# Altium project BeagleBone_Card.PrjPcb (part 4 of 4)

## Sheet 10_HDMI.SchDoc
size A3; Engineer: Mehmet Selcuk Yayan; Organization: Procenne
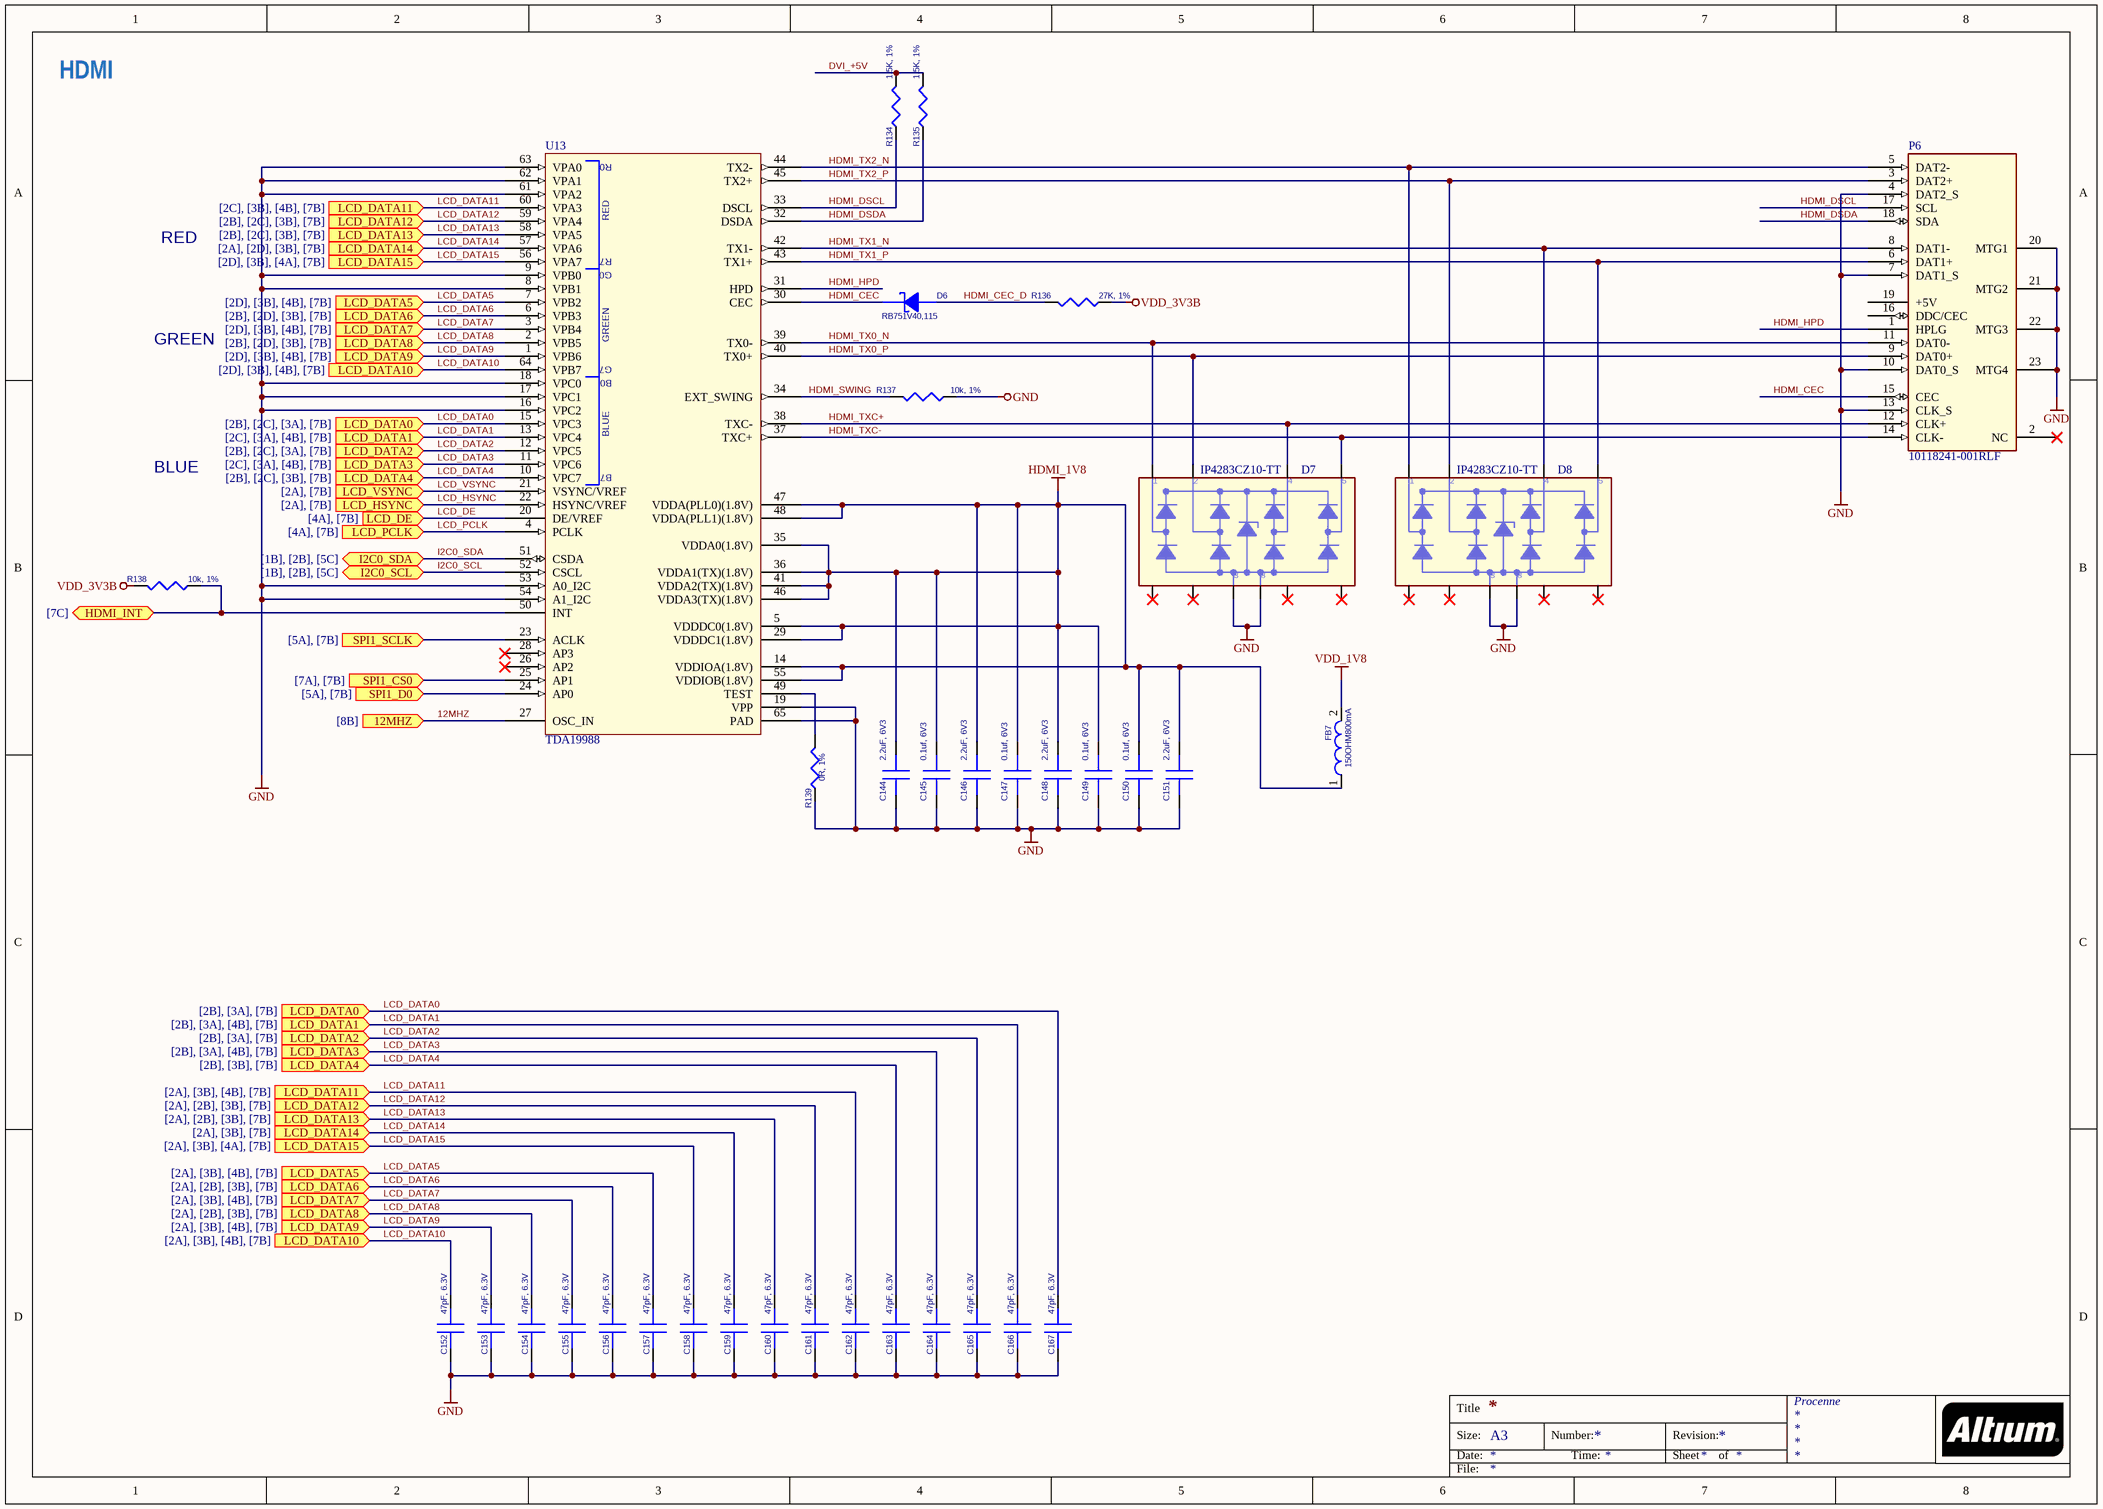
[diagram p11: 10_HDMI.SchDoc]

### Parts
C144  2.2uF, 6V3  [402]
C145  0.1uf, 6V3  [402]
C146  2.2uF, 6V3  [402]
C147  0.1uf, 6V3  [402]
C148  2.2uF, 6V3  [402]
C149  0.1uf, 6V3  [402]
C150  0.1uf, 6V3  [402]
C151  2.2uF, 6V3  [402]
C152  47pF, 6.3V  [402]
C153  47pF, 6.3V  [402]
C154  47pF, 6.3V  [402]
C155  47pF, 6.3V  [402]
C156  47pF, 6.3V  [402]
C157  47pF, 6.3V  [402]
C158  47pF, 6.3V  [402]
C159  47pF, 6.3V  [402]
C160  47pF, 6.3V  [402]
C161  47pF, 6.3V  [402]
C162  47pF, 6.3V  [402]
C163  47pF, 6.3V  [402]
C164  47pF, 6.3V  [402]
C165  47pF, 6.3V  [402]
C166  47pF, 6.3V  [402]
C167  47pF, 6.3V  [402]
D6  RB751V40,115  [SOD323]
D7  IP4283CZ10-TT  [TSSOP10]
D8  IP4283CZ10-TT  [TSSOP10]
FB7  150OHM800mA  [SM-7351-IND-0805]
P6  10118241-001RLF  [CONN19_HDMI]
R134  1.5K, 1%  [402]
R135  1.5K, 1%  [402]
R136  27K, 1%  [402]
R137  10k, 1%  [402]
R138  10k, 1%  [402]
R139  0R, 1%  [402]
U13  TDA19988  [QFN64S9X9P5]

### Ports
12MHZ (in, see [8B]), HDMI_INT (bidir, see [7C]), I2C0_SCL (bidir, see [1B], [2B], [5C]), I2C0_SDA (bidir, see [1B], [2B], [5C]), LCD_DATA0 (in, see [2B], [2C], [3A], [7B]), LCD_DATA0 (in, see [2B], [3A], [7B]), LCD_DATA1 (in, see [2B], [3A], [4B], [7B]), LCD_DATA1 (in, see [2C], [3A], [4B], [7B]), LCD_DATA2 (in, see [2B], [2C], [3A], [7B]), LCD_DATA2 (in, see [2B], [3A], [7B]), LCD_DATA3 (in, see [2B], [3A], [4B], [7B]), LCD_DATA3 (in, see [2C], [3A], [4B], [7B]), LCD_DATA4 (in, see [2B], [2C], [3B], [7B]), LCD_DATA4 (in, see [2B], [3B], [7B]), LCD_DATA5 (in, see [2A], [3B], [4B], [7B]), LCD_DATA5 (in, see [2D], [3B], [4B], [7B]), LCD_DATA6 (in, see [2A], [2B], [3B], [7B]), LCD_DATA6 (in, see [2B], [2D], [3B], [7B]), LCD_DATA7 (in, see [2A], [3B], [4B], [7B]), LCD_DATA7 (in, see [2D], [3B], [4B], [7B]), LCD_DATA8 (in, see [2A], [2B], [3B], [7B]), LCD_DATA8 (in, see [2B], [2D], [3B], [7B]), LCD_DATA9 (in, see [2A], [3B], [4B], [7B]), LCD_DATA9 (in, see [2D], [3B], [4B], [7B]), LCD_DATA10 (in, see [2A], [3B], [4B], [7B]), LCD_DATA10 (in, see [2D], [3B], [4B], [7B]), LCD_DATA11 (in, see [2A], [3B], [4B], [7B]), LCD_DATA11 (in, see [2C], [3B], [4B], [7B]), LCD_DATA12 (in, see [2A], [2B], [3B], [7B]), LCD_DATA12 (in, see [2B], [2C], [3B], [7B]), LCD_DATA13 (in, see [2A], [2B], [3B], [7B]), LCD_DATA13 (in, see [2B], [2C], [3B], [7B]), LCD_DATA14 (in, see [2A], [2D], [3B], [7B]), LCD_DATA14 (in, see [2A], [3B], [7B]), LCD_DATA15 (in, see [2A], [3B], [4A], [7B]), LCD_DATA15 (in, see [2D], [3B], [4A], [7B]), LCD_DE (in, see [4A], [7B]), LCD_HSYNC (in, see [2A], [7B]), LCD_PCLK (in, see [4A], [7B]), LCD_VSYNC (in, see [2A], [7B]), SPI1_CS0 (in, see [7A], [7B]), SPI1_D0 (in, see [5A], [7B]), SPI1_SCLK (in, see [5A], [7B])

### Nets
GND: C144.2 C145.2 C146.2 C147.2 C148.2 C149.2 C150.2 C151.2 C152.2 C153.2 C154.2 C155.2 C156.2 C157.2 C158.2 C159.2 C160.2 C161.2 C162.2 C163.2 C164.2 C165.2 C166.2 C167.2 D7.3 D7.8 D8.3 D8.8 P6.4(DAT2_S) P6.7(DAT1_S) P6.10(DAT0_S) P6.13(CLK_S) P6.20(MTG1) P6.21(MTG2) P6.22(MTG3) P6.23(MTG4) R137.2(P2) R139.2(P2) U13.8(VPB1) U13.9(VPB0) U13.16(VPC2) U13.17(VPC1) U13.18(VPC0) U13.19(VPP) U13.53(A0_I2C) U13.54(A1_I2C) U13.61(VPA2) U13.62(VPA1) U13.63(VPA0) U13.65(PAD)
HDMI_1V8: C144.1 C145.1 C146.1 C147.1 C148.1 C149.1 C150.1 C151.1 FB7.1 U13.5(VDDDC0(1.8V)) U13.14(VDDIOA(1.8V)) U13.29(VDDDC1(1.8V)) U13.35(VDDA0(1.8V)) U13.36(VDDA1(TX)(1.8V)) U13.41(VDDA2(TX)(1.8V)) U13.46(VDDA3(TX)(1.8V)) U13.47(VDDA(PLL0)(1.8V)) U13.48(VDDA(PLL1)(1.8V)) U13.55(VDDIOB(1.8V))
VDD_1V8: FB7.2
VDD_3V3B: R136.2(P2) R138.1(P1)
12MHZ: U13.27(OSC_IN) ; port 12MHZ
DVI_+5V: R134.1(P1) R135.1(P1)
HDMI_CEC: D6.1(C) P6.15(CEC) U13.30(CEC)
HDMI_CEC_D: D6.2(A) R136.1(P1)
HDMI_DSCL: P6.17(SCL) R134.2(P2) U13.33(DSCL)
HDMI_DSDA: P6.18(SDA) R135.2(P2) U13.32(DSDA)
HDMI_HPD: P6.1(HPLG) U13.31(HPD)
HDMI_INT: R138.2(P2) U13.50(INT) ; port HDMI_INT
HDMI_SWING: R137.1(P1) U13.34(EXT_SWING)
HDMI_TX0_N: D7.1 P6.11(DAT0-) U13.39(TX0-)
HDMI_TX0_P: D7.2 P6.9(DAT0+) U13.40(TX0+)
HDMI_TX1_N: D8.4 P6.8(DAT1-) U13.42(TX1-)
HDMI_TX1_P: D8.5 P6.6(DAT1+) U13.43(TX1+)
HDMI_TX2_N: D8.1 P6.5(DAT2-) U13.44(TX2-)
HDMI_TX2_P: D8.2 P6.3(DAT2+) U13.45(TX2+)
HDMI_TXC+: D7.4 P6.12(CLK+) U13.38(TXC-)
HDMI_TXC-: D7.5 P6.14(CLK-) U13.37(TXC+)
I2C0_SCL: U13.52(CSCL) ; port I2C0_SCL
I2C0_SDA: U13.51(CSDA) ; port I2C0_SDA
LCD_DATA0: C167.1 U13.15(VPC3) ; port LCD_DATA0
LCD_DATA1: C166.1 U13.13(VPC4) ; port LCD_DATA1
LCD_DATA2: C165.1 U13.12(VPC5) ; port LCD_DATA2
LCD_DATA3: C164.1 U13.11(VPC6) ; port LCD_DATA3
LCD_DATA4: C163.1 U13.10(VPC7) ; port LCD_DATA4
LCD_DATA5: C157.1 U13.7(VPB2) ; port LCD_DATA5
LCD_DATA6: C156.1 U13.6(VPB3) ; port LCD_DATA6
LCD_DATA7: C155.1 U13.3(VPB4) ; port LCD_DATA7
LCD_DATA8: C154.1 U13.2(VPB5) ; port LCD_DATA8
LCD_DATA9: C153.1 U13.1(VPB6) ; port LCD_DATA9
LCD_DATA10: C152.1 U13.64(VPB7) ; port LCD_DATA10
LCD_DATA11: C162.1 U13.60(VPA3) ; port LCD_DATA11
LCD_DATA12: C161.1 U13.59(VPA4) ; port LCD_DATA12
LCD_DATA13: C160.1 U13.58(VPA5) ; port LCD_DATA13
LCD_DATA14: C159.1 U13.57(VPA6) ; port LCD_DATA14
LCD_DATA15: C158.1 U13.56(VPA7) ; port LCD_DATA15
LCD_DE: U13.20(DE/VREF) ; port LCD_DE
LCD_HSYNC: U13.22(HSYNC/VREF) ; port LCD_HSYNC
LCD_PCLK: U13.4(PCLK) ; port LCD_PCLK
LCD_VSYNC: U13.21(VSYNC/VREF) ; port LCD_VSYNC
SPI1_CS0: U13.25(AP1) ; port SPI1_CS0
SPI1_D0: U13.24(AP0) ; port SPI1_D0
SPI1_SCLK: U13.23(ACLK) ; port SPI1_SCLK
NetR139_1: R139.1(P1) U13.49(TEST)

Not connected (* = marked no-connect by the designer): D7 6* 7* 9* 10*; D8 6* 7* 9* 10*; P6 2(NC)* 16(DDC/CEC) 19(+5V); U13 26(AP2)* 28(AP3)*

### Notes on the sheet
- HDMI
- RED
- GREEN
- BLUE
- Title
- Size:
- Date:
- A3
- Number:
- Time:
- Revision:
- Sheet
- of
- File:
- (in symbol TDA19988) R0; RED; R7; G0; GREEN; G7; B0; BLUE; B7

### Library data of the parts
C144 C146 C148 C151 = CAP SMD: CAP CER 2.2UF 6.3V 10% X5R 0402; Manufacturer: TDK Corporation; Manufacturer Part Number: C1005X5R0J225K050BC; Capacitance: 2.2µF; Supplier 1: Digi-Key; Supplier Part Number 1: 445-6847-6-ND; RoHS: RoHS Compliant; Category: Capacitors; Stock 1: 186346; Pricing 1: 1=0.24, 10=0.2, 100=0.1, 250=0.075, 500=0.06626, 1000=0.05875, 5000=0.04875 (USD); Voltage - Rated: 6.3V; Tolerance: ±10%; Temperature Coefficient: X5R; Mounting Type: Surface Mount, MLCC; Operating Temperature: -55°C ~ 85°C; Applications: General Purpose; Ratings: -; Package / Case: 0402 (1005 Metric); Size / Dimension: 0.039" L x 0.020" W (1.00mm x 0.50mm); Height - Seated (Max): -; Thickness (Max): 0.022" (0.55mm); Lead Spacing: -; Features: -; Packaging: Digi-Reel®; Lead Style: -; ComponentLink1URL: http://product.tdk.com/capacitor/mlcc/en/documents/mlcc_commercial_general_en.pdf; ComponentLink1Description: http://product.tdk.com/capacitor/mlcc/en/documents/mlcc_commercial_general_en.pdf
C145 C147 C149 C150 = CAP SMD: CAP CER 0.1UF 6.3V 10% X5R 0402; Manufacturer: TDK Corporation; Manufacturer Part Number: C1005X5R0J104K050BA; Capacitance: 0.1µF; Supplier 1: Digi-Key; Supplier Part Number 1: 445-1266-6-ND; RoHS: RoHS Compliant; Category: Capacitors; Stock 1: 127094; Pricing 1: 1=0.1, 10=0.026, 100=0.0121, 250=0.00992, 500=0.00848, 1000=0.0066, 5000=0.0055 (USD); Voltage - Rated: 6.3V; Tolerance: ±10%; Temperature Coefficient: X5R; Mounting Type: Surface Mount, MLCC; Operating Temperature: -55°C ~ 85°C; Applications: General Purpose; Ratings: -; Package / Case: 0402 (1005 Metric); Size / Dimension: 0.039" L x 0.020" W (1.00mm x 0.50mm); Height - Seated (Max): -; Thickness (Max): 0.022" (0.55mm); Lead Spacing: -; Features: -; Packaging: Digi-Reel®; Lead Style: -; ComponentLink1URL: http://product.tdk.com/capacitor/mlcc/en/documents/mlcc_commercial_general_en.pdf; ComponentLink1Description: http://product.tdk.com/capacitor/mlcc/en/documents/mlcc_commercial_general_en.pdf
C152-C167 = CAP SMD: CAP CER 47PF 50V 5% NP0 0402; Manufacturer: TDK Corporation; Manufacturer Part Number: C1005C0G1H470J050BA; Temperature Coefficient: C0G, NP0; Supplier 1: Digi-Key; Supplier Part Number 1: 445-1243-6-ND; RoHS: RoHS Compliant; Category: Capacitors; Stock 1: 0; Pricing 1: 1=0.1, 10=0.024, 100=0.011, 250=0.009, 500=0.0077, 1000=0.006, 5000=0.005 (USD); Capacitance: 47pF; Voltage - Rated: 50V; Tolerance: ±5%; Mounting Type: Surface Mount, MLCC; Operating Temperature: -55°C ~ 125°C; Applications: General Purpose; Ratings: -; Package / Case: 0402 (1005 Metric); Size / Dimension: 0.039" L x 0.020" W (1.00mm x 0.50mm); Height - Seated (Max): -; Thickness (Max): 0.022" (0.55mm); Lead Spacing: -; Features: -; Packaging: Digi-Reel®; Lead Style: -; ComponentLink1URL: http://product.tdk.com/capacitor/mlcc/en/documents/mlcc_commercial_general_en.pdf; ComponentLink1Description: http://product.tdk.com/capacitor/mlcc/en/documents/mlcc_commercial_general_en.pdf
D6 = Zener: DIODE SCHOTTKY 40V 120MA SOD323; Manufacturer: NXP Semiconductors; Current - Average Rectified (Io): 120mA (DC); Voltage - Forward (Vf) (Max) @ If: 370mV @ 1mA; Speed: Small Signal =< 200mA (Io), Any Speed; Current - Reverse Leakage @ Vr: 500nA @ 30V; Capacitance @ Vr, F: 2pF @ 1V, 1MHz; Supplier 1: Digi-Key; Supplier Part Number 1: 568-8119-6-ND; Manufacturer Part Number: RB751V40,115; RoHS: RoHS Compliant; Category: Discrete Semiconductor Products; Stock 1: 5326; Pricing 1: 1=0.29, 10=0.26, 25=0.1872, 100=0.1456, 250=0.09152, 500=0.07798, 1000=0.05313 (USD); Diode Type: Schottky; Voltage - DC Reverse (Vr) (Max): 40V; Reverse Recovery Time (trr): -; Mounting Type: Surface Mount; Package / Case: SC-76, SOD-323; Supplier Device Package: SOD-323; Packaging: Digi-Reel®; ComponentLink1URL: http://www.nxp.com/documents/data_sheet/RB751_SER.pdf; ComponentLink1Description: http://www.nxp.com/documents/data_sheet/RB751_SER.pdf
D7 D8 = 32CTQ030/TO_1: DIODE ESD PROT HDMI 10TSSOP; Manufacturer: NXP Semiconductors; Manufacturer Part Number: IP4283CZ10-TT,118; Voltage - Reverse Standoff (Typ): 3V; Voltage - Breakdown: 6V; Polarization: 4 Channel Array - Unidirectional; Supplier 1: Digi-Key; Supplier Part Number 1: 568-5875-6-ND; RoHS: RoHS Compliant; Category: Circuit Protection; Stock 1: 1067; Pricing 1: 1=0.85, 10=0.743, 25=0.6568, 100=0.5724, 250=0.49828, 500=0.42416, 1000=0.33974 (USD); Power (Watts): -; Mounting Type: Surface Mount; Package / Case: 10-TFSOP, 10-MSOP (0.118", 3.00mm Width); Supplier Device Package: 10-TSSOP; Packaging: Digi-Reel®; ComponentLink1URL: http://media.digikey.com/pdf/Data%20Sheets/NXP%20PDFs/IP4283CZ10.pdf; ComponentLink1Description: http://media.digikey.com/pdf/Data%20Sheets/NXP%20PDFs/IP4283CZ10.pdf
FB7 = IND: FERRITE 800MA 150 OHM 0805 SMD; Manufacturer: Laird-Signal Integrity Products; Manufacturer Part Number: LI0805H151R-10; Impedance @ Frequency: 150 Ohm @ 100MHz; DC Resistance (DCR): 150 mOhm Max; Filter Type: Differential Mode - Single; Supplier 1: Digi-Key; Supplier Part Number 1: 240-2384-6-ND; RoHS: RoHS Compliant; Category: Filters; Stock 1: 10144; Pricing 1: 1=0.1, 10=0.07, 25=0.064, 50=0.0574, 100=0.0421, 250=0.03064, 500=0.02808, 1000=0.02424 (USD); Current Rating: 800mA; Package / Case: 0805 (2012 Metric); Mounting Type: Surface Mount; Packaging: Digi-Reel®; Height (Max): 0.043" (1.10mm); Size / Dimension: 0.079" L x 0.049" W (2.00mm x 1.25mm); ComponentLink1URL: http://www.lairdtech.com/WorkArea/linkit.aspx?LinkIdentifier=id&ItemID=4912; ComponentLink1Description: http://www.lairdtech.com/WorkArea/linkit.aspx?LinkIdentifier=id&ItemID=4912
P6 = Micro HDMI: CONN HDMI RECPT 19POS SMT R/A; Manufacturer: FCI; Number of Contacts: 19; Gender: Receptacle; Supplier 1: Digi-Key; Supplier Part Number 1: 609-4615-6-ND; Manufacturer Part Number: 10118241-001RLF; RoHS: RoHS Compliant; Category: Connectors, Interconnects; Stock 1: 6779; Pricing 1: 1=1.34, 10=1.174, 25=1.1052, 50=1.059, 100=1.013, 250=0.92092 (USD); Connector Type: HDMI; Specifications: -; Mounting Type: Surface Mount, Right Angle, Horizontal; Features: Shielded, Solder Retention; Packaging: Digi-Reel®; Ingress Protection: -; ComponentLink1URL: http://portal.fciconnect.com/Comergent//fci/drawing/10118241.pdf; ComponentLink1Description: http://portal.fciconnect.com/Comergent//fci/drawing/10118241.pdf
R134 R135 = RES SMD: RES 1.50K OHM 1/16W 1% 0402 SMD; Manufacturer: Yageo; Manufacturer Part Number: RC0402FR-071K5L; Power (Watts): 0.063W, 1/16W; Temperature Coefficient: ±100ppm/°C; Supplier 1: Digi-Key; Supplier Part Number 1: 311-1.50KLRDKR-ND; RoHS: RoHS Compliant; Category: Resistors; Stock 1: 434146; Pricing 1: 1=0.1, 10=0.014, 25=0.0104, 100=0.0063, 250=0.0054, 500=0.00382, 1000=0.0027, 2500=0.00234, 5000=0.00203 (USD); Resistance (Ohms): 1.5k; Composition: Thick Film; Features: -; Tolerance: ±1%; Package / Case: 0402 (1005 Metric); Supplier Device Package: 0402; Size / Dimension: 0.039" L x 0.020" W (1.00mm x 0.50mm); Height: 0.016" (0.40mm); Number of Terminations: 2; Packaging: Digi-Reel®; ComponentLink1URL: http://www.yageo.com/documents/recent/PYu-RC0402_51_RoHS_L_6.pdf; ComponentLink1Description: http://www.yageo.com/documents/recent/PYu-RC0402_51_RoHS_L_6.pdf
R136 = RES SMD: RES 27.0K OHM 1/16W 1% 0402 SMD; Manufacturer: Yageo; Manufacturer Part Number: RC0402FR-0727KL; Power (Watts): 0.063W, 1/16W; Temperature Coefficient: ±100ppm/°C; Supplier 1: Digi-Key; Supplier Part Number 1: 311-27.0KLRDKR-ND; RoHS: RoHS Compliant; Category: Resistors; Stock 1: 115508; Pricing 1: 1=0.1, 10=0.014, 25=0.0104, 100=0.0063, 250=0.0054, 500=0.00382, 1000=0.0027, 2500=0.00234, 5000=0.00203 (USD); Resistance (Ohms): 27k; Composition: Thick Film; Features: -; Tolerance: ±1%; Package / Case: 0402 (1005 Metric); Supplier Device Package: 0402; Size / Dimension: 0.039" L x 0.020" W (1.00mm x 0.50mm); Height: 0.016" (0.40mm); Number of Terminations: 2; Packaging: Digi-Reel®; ComponentLink1URL: http://www.yageo.com/documents/recent/PYu-RC0402_51_RoHS_L_6.pdf; ComponentLink1Description: http://www.yageo.com/documents/recent/PYu-RC0402_51_RoHS_L_6.pdf
R137 R138 = RES SMD: RES 10K OHM 1/16W 5% 0402 SMD; Manufacturer: Rohm Semiconductor; Manufacturer Part Number: MCR01MZPJ103; Power (Watts): 0.063W, 1/16W; Temperature Coefficient: ±200ppm/°C; Supplier 1: Digi-Key; Supplier Part Number 1: RHM10KJDKR-ND; RoHS: RoHS Compliant; Category: Resistors; Stock 1: 460442; Pricing 1: 1=0.1, 10=0.019, 25=0.014, 100=0.0078, 250=0.00596, 500=0.00476, 1000=0.0035, 5000=0.00251 (USD); Resistance (Ohms): 10k; Composition: Thick Film; Features: Automotive AEC-Q200 Qualified; Tolerance: ±5%; Package / Case: 0402 (1005 Metric); Supplier Device Package: 0402 (1005 Metric); Size / Dimension: 0.039" L x 0.020" W (1.00mm x 0.50mm); Height: 0.016" (0.40mm); Number of Terminations: 2; Packaging: Digi-Reel®; ComponentLink1URL: http://rohmfs.rohm.com/en/products/databook/datasheet/passive/resistor/chip_resistor/mcr_a.pdf; ComponentLink1Description: http://rohmfs.rohm.com/en/products/databook/datasheet/passive/resistor/chip_resistor/mcr_a.pdf
R139 = RES SMD: RES 0.0 OHM 1/16W 0402 SMD; Manufacturer: Yageo; Manufacturer Part Number: RC0402JR-070RL; Resistance (Ohms): 0.0; Power (Watts): 0.063W, 1/16W; Tolerance: Jumper; Supplier 1: Digi-Key; Supplier Part Number 1: 311-0.0JRDKR-ND; RoHS: RoHS Compliant; Category: Resistors; Stock 1: 4565215; Pricing 1: 1=0.1, 10=0.012, 25=0.0092, 100=0.0055, 250=0.00476, 500=0.00336, 1000=0.00237, 2500=0.00206, 5000=0.00178 (USD); Composition: Thick Film; Features: -; Temperature Coefficient: -; Package / Case: 0402 (1005 Metric); Supplier Device Package: 0402; Size / Dimension: 0.039" L x 0.020" W (1.00mm x 0.50mm); Height: 0.016" (0.40mm); Number of Terminations: 2; Packaging: Digi-Reel®; ComponentLink1URL: http://www.yageo.com/documents/recent/PYu-RC0402_51_RoHS_L_6.pdf; ComponentLink1Description: http://www.yageo.com/documents/recent/PYu-RC0402_51_RoHS_L_6.pdf
U13 = TDA19988: IC HDMI TRANSMITTER 64-HVQFN; Manufacturer: NXP Semiconductors; Manufacturer Part Number: TDA19988AHN/C1,551; Supplier 1: Digi-Key; Supplier Part Number 1: TDA19988AHN/C1,551-ND; RoHS: RoHS Compliant; Category: Integrated Circuits (ICs); Stock 1: 0; Pricing 1: 260=4.59 (USD); Type: HDMI Transmitter; Applications: Set-Top Boxes; Mounting Type: Surface Mount; Package / Case: 64-VFQFN Exposed Pad; Supplier Device Package: 64-HVQFN (9x9); Packaging: Tray

## Sheet 11_Miscellaneous.SchDoc
size A3; Engineer: Mehmet Selcuk Yayan; Organization: Procenne
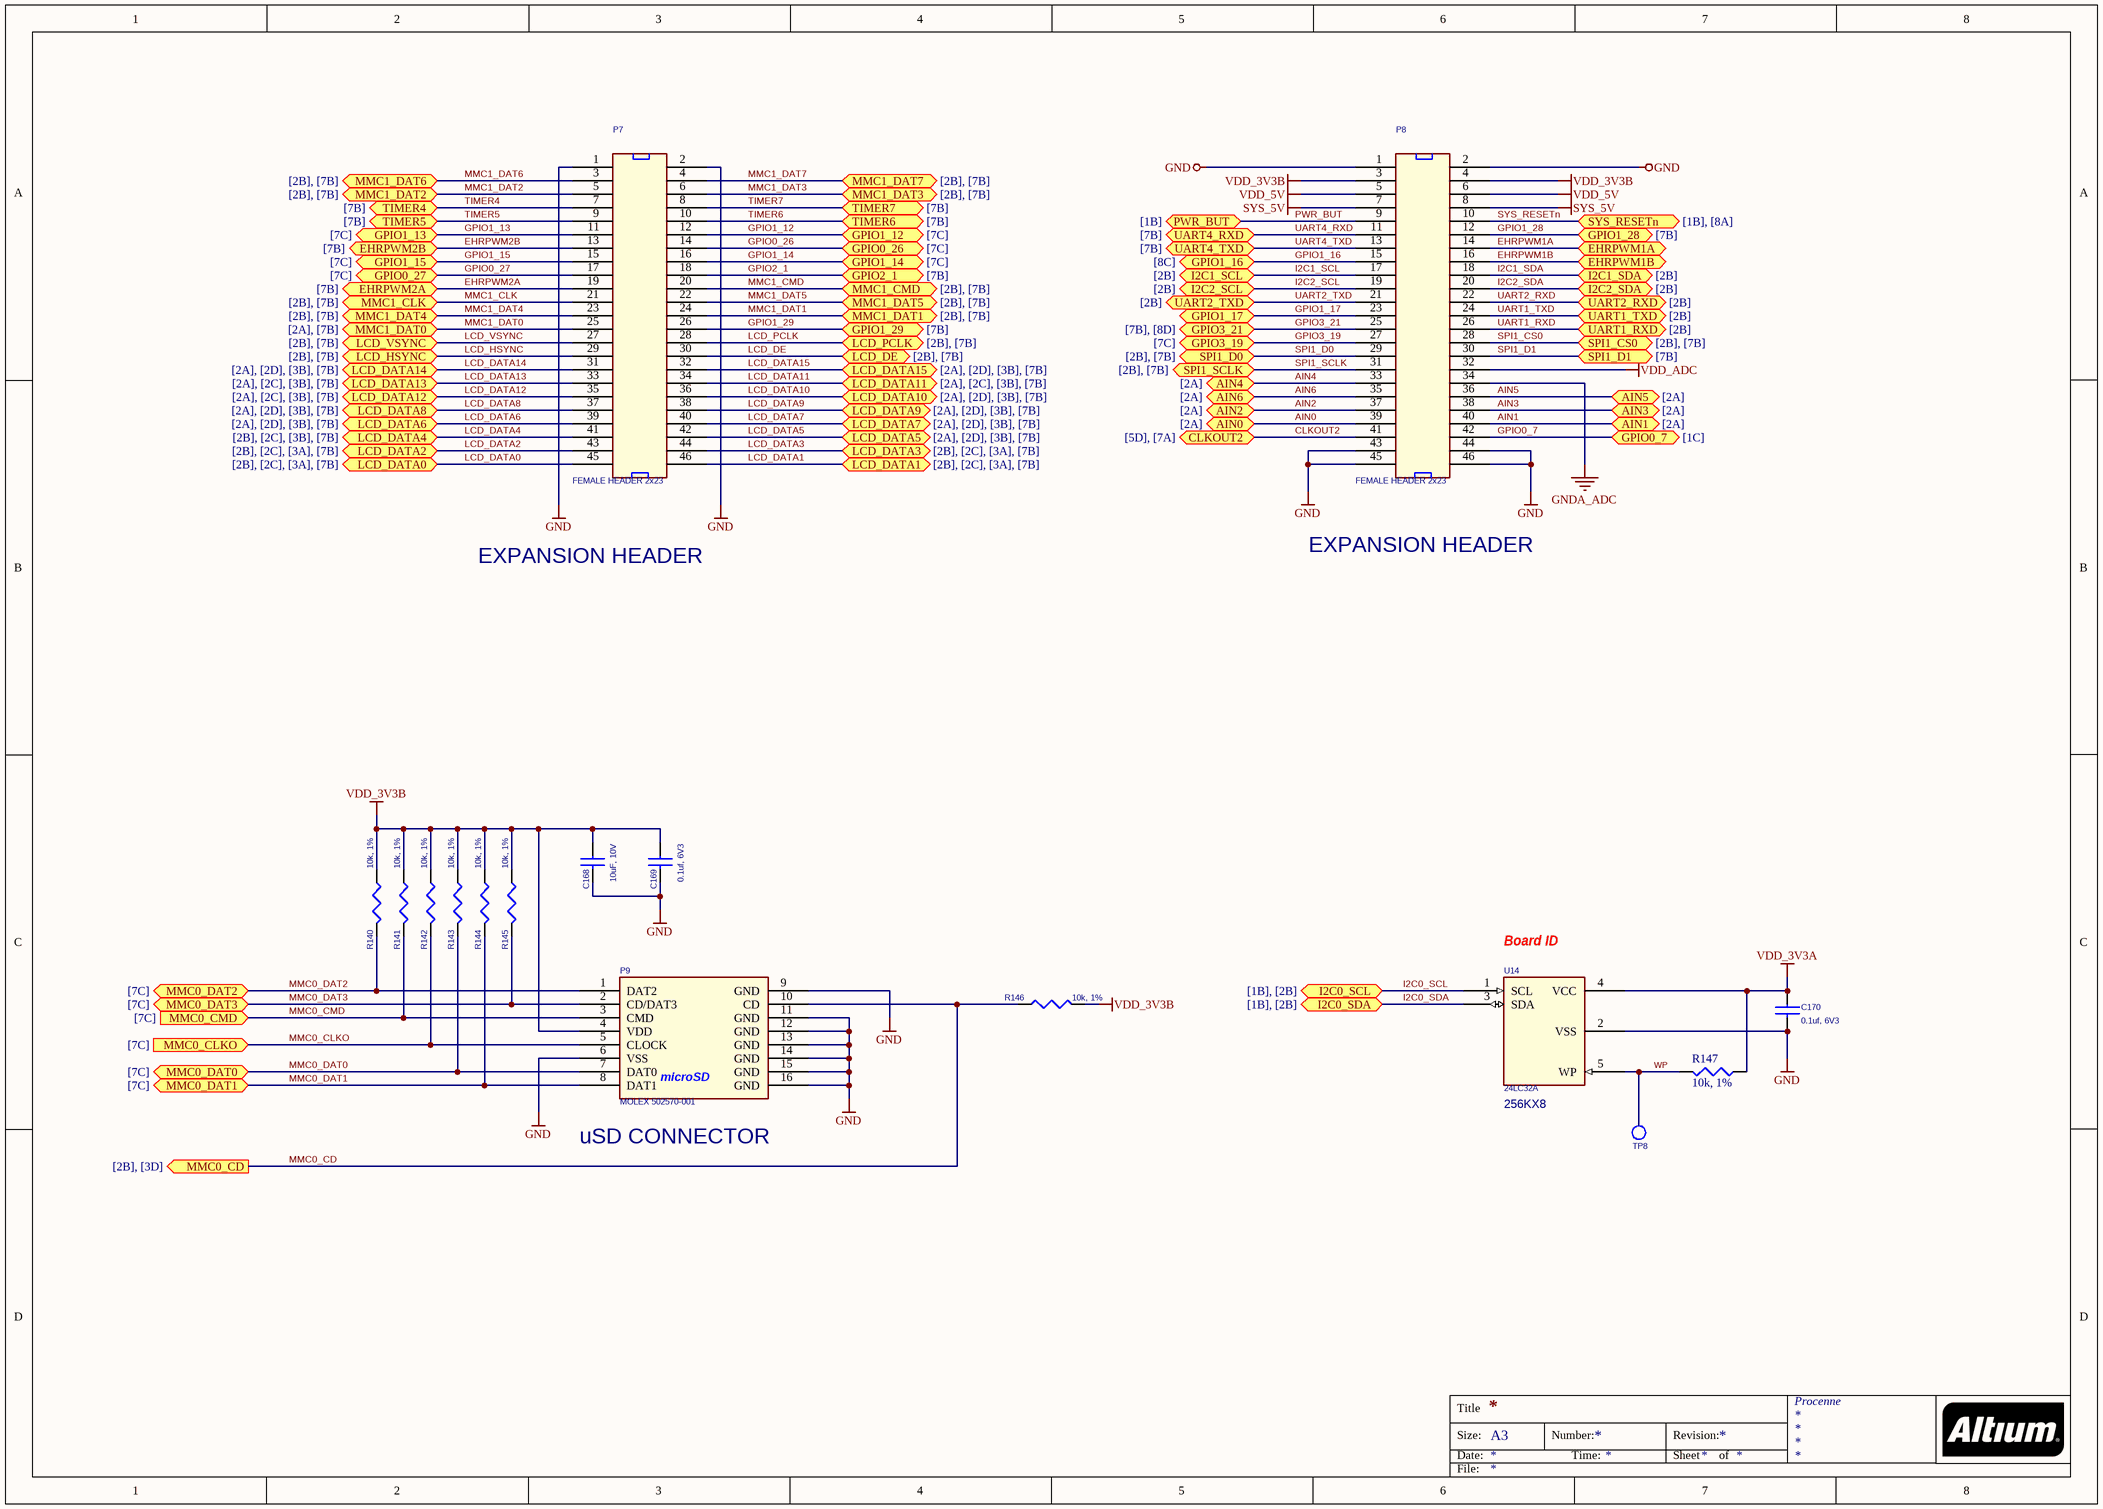
[diagram p12: 11_Miscellaneous.SchDoc]

### Parts
C168  10uF, 10V  [805]
C169  0.1uf, 6V3  [402]
C170  0.1uf, 6V3  [402]
P7  FEMALE HEADER 2x23  [HEADER23X2]
P8  FEMALE HEADER 2x23  [HEADER23X2]
P9  MOLEX 502570-001  [SD-MICRO-SCHA5B0300]
R140  10k, 1%  [402]
R141  10k, 1%  [402]
R142  10k, 1%  [402]
R143  10k, 1%  [402]
R144  10k, 1%  [402]
R145  10k, 1%  [402]
R146  10k, 1%  [402]
R147  10k, 1%  [402]
TP8  TESTPT1  [tp1-8040]  (value not drawn)  (no BOM)
U14  24LC32A  [SOT23-5]

### Ports
AIN0 (bidir, see [2A]), AIN1 (bidir, see [2A]), AIN2 (bidir, see [2A]), AIN3 (bidir, see [2A]), AIN4 (bidir, see [2A]), AIN5 (bidir, see [2A]), AIN6 (bidir, see [2A]), CLKOUT2 (bidir, see [5D], [7A]), EHRPWM1A (bidir), EHRPWM1B (bidir), EHRPWM2A (bidir, see [7B]), EHRPWM2B (bidir, see [7B]), GPIO0_7 (bidir, see [1C]), GPIO0_26 (bidir, see [7C]), GPIO0_27 (bidir, see [7C]), GPIO1_12 (bidir, see [7C]), GPIO1_13 (bidir, see [7C]), GPIO1_14 (bidir, see [7C]), GPIO1_15 (bidir, see [7C]), GPIO1_16 (bidir, see [8C]), GPIO1_17 (bidir), GPIO1_28 (bidir, see [7B]), GPIO1_29 (bidir, see [7B]), GPIO2_1 (bidir, see [7B]), GPIO3_19 (bidir, see [7C]), GPIO3_21 (bidir, see [7B], [8D]), I2C0_SCL (bidir, see [1B], [2B]), I2C0_SDA (bidir, see [1B], [2B]), I2C1_SCL (bidir, see [2B]), I2C1_SDA (bidir, see [2B]), I2C2_SCL (bidir, see [2B]), I2C2_SDA (bidir, see [2B]), LCD_DATA0 (bidir, see [2B], [2C], [3A], [7B]), LCD_DATA1 (bidir, see [2B], [2C], [3A], [7B]), LCD_DATA2 (bidir, see [2B], [2C], [3A], [7B]), LCD_DATA3 (bidir, see [2B], [2C], [3A], [7B]), LCD_DATA4 (bidir, see [2B], [2C], [3B], [7B]), LCD_DATA5 (bidir, see [2A], [2D], [3B], [7B]), LCD_DATA6 (bidir, see [2A], [2D], [3B], [7B]), LCD_DATA7 (bidir, see [2A], [2D], [3B], [7B]), LCD_DATA8 (bidir, see [2A], [2D], [3B], [7B]), LCD_DATA9 (bidir, see [2A], [2D], [3B], [7B]), LCD_DATA10 (bidir, see [2A], [2D], [3B], [7B]), LCD_DATA11 (bidir, see [2A], [2C], [3B], [7B]), LCD_DATA12 (bidir, see [2A], [2C], [3B], [7B]), LCD_DATA13 (bidir, see [2A], [2C], [3B], [7B]), LCD_DATA14 (bidir, see [2A], [2D], [3B], [7B]), LCD_DATA15 (bidir, see [2A], [2D], [3B], [7B]), LCD_DE (bidir, see [2B], [7B]), LCD_HSYNC (bidir, see [2B], [7B]), LCD_PCLK (bidir, see [2B], [7B]), LCD_VSYNC (bidir, see [2B], [7B]), MMC0_CD (out, see [2B], [3D]), MMC0_CLKO (in, see [7C]), MMC0_CMD (in, see [7C]), MMC0_DAT0 (bidir, see [7C]), MMC0_DAT1 (bidir, see [7C]), MMC0_DAT2 (bidir, see [7C]), MMC0_DAT3 (bidir, see [7C]), MMC1_CLK (bidir, see [2B], [7B]), MMC1_CMD (bidir, see [2B], [7B]), MMC1_DAT0 (bidir, see [2A], [7B]), MMC1_DAT1 (bidir, see [2B], [7B]), MMC1_DAT2 (bidir, see [2B], [7B]), MMC1_DAT3 (bidir, see [2B], [7B]), MMC1_DAT4 (bidir, see [2B], [7B]), MMC1_DAT5 (bidir, see [2B], [7B]), MMC1_DAT6 (bidir, see [2B], [7B]), MMC1_DAT7 (bidir, see [2B], [7B]), PWR_BUT (bidir, see [1B]), SPI1_CS0 (bidir, see [2B], [7B]), SPI1_D0 (bidir, see [2B], [7B]), SPI1_D1 (bidir, see [7B]), SPI1_SCLK (bidir, see [2B], [7B]), SYS_RESETn (bidir, see [1B], [8A]), TIMER4 (bidir, see [7B]), TIMER5 (bidir, see [7B]), TIMER6 (bidir, see [7B]), TIMER7 (bidir, see [7B]), UART1_RXD (bidir, see [2B]), UART1_TXD (bidir, see [2B]), UART2_RXD (bidir, see [2B]), UART2_TXD (bidir, see [2B]), UART4_RXD (bidir, see [7B]), UART4_TXD (bidir, see [7B])

### Nets
GND: C168.2 C169.2 C170.2 P7.1 P7.2 P8.1 P8.2 P8.43 P8.44 P8.45 P8.46 P9.6(VSS) P9.9(GND) P9.11(GND) P9.12(GND) P9.13(GND) P9.14(GND) P9.15(GND) P9.16(GND) U14.2(VSS)
GNDA_ADC: P8.34
SYS_5V: P8.7 P8.8
VDD_3V3A: C170.1 R147.1 U14.4(VCC)
VDD_3V3B: C168.1 C169.1 P8.3 P8.4 P9.4(VDD) R140.1 R141.1 R142.1 R143.1 R144.1 R145.1 R146.2
VDD_5V: P8.5 P8.6
VDD_ADC: P8.32
AIN0: P8.39 ; port AIN0
AIN1: P8.40 ; port AIN1
AIN2: P8.37 ; port AIN2
AIN3: P8.38 ; port AIN3
AIN4: P8.33 ; port AIN4
AIN5: P8.36 ; port AIN5
AIN6: P8.35 ; port AIN6
CLKOUT2: P8.41 ; port CLKOUT2
EHRPWM1A: P8.14 ; port EHRPWM1A
EHRPWM1B: P8.16 ; port EHRPWM1B
EHRPWM2A: P7.19 ; port EHRPWM2A
EHRPWM2B: P7.13 ; port EHRPWM2B
GPIO0_7: P8.42 ; port GPIO0_7
GPIO0_26: P7.14 ; port GPIO0_26
GPIO0_27: P7.17 ; port GPIO0_27
GPIO1_12: P7.12 ; port GPIO1_12
GPIO1_13: P7.11 ; port GPIO1_13
GPIO1_14: P7.16 ; port GPIO1_14
GPIO1_15: P7.15 ; port GPIO1_15
GPIO1_16: P8.15 ; port GPIO1_16
GPIO1_17: P8.23 ; port GPIO1_17
GPIO1_28: P8.12 ; port GPIO1_28
GPIO1_29: P7.26 ; port GPIO1_29
GPIO2_1: P7.18 ; port GPIO2_1
GPIO3_19: P8.27 ; port GPIO3_19
GPIO3_21: P8.25 ; port GPIO3_21
I2C0_SCL: U14.1(SCL) ; port I2C0_SCL
I2C0_SDA: U14.3(SDA) ; port I2C0_SDA
I2C1_SCL: P8.17 ; port I2C1_SCL
I2C1_SDA: P8.18 ; port I2C1_SDA
I2C2_SCL: P8.19 ; port I2C2_SCL
I2C2_SDA: P8.20 ; port I2C2_SDA
LCD_DATA0: P7.45 ; port LCD_DATA0
LCD_DATA1: P7.46 ; port LCD_DATA1
LCD_DATA2: P7.43 ; port LCD_DATA2
LCD_DATA3: P7.44 ; port LCD_DATA3
LCD_DATA4: P7.41 ; port LCD_DATA4
LCD_DATA5: P7.42 ; port LCD_DATA5
LCD_DATA6: P7.39 ; port LCD_DATA6
LCD_DATA7: P7.40 ; port LCD_DATA7
LCD_DATA8: P7.37 ; port LCD_DATA8
LCD_DATA9: P7.38 ; port LCD_DATA9
LCD_DATA10: P7.36 ; port LCD_DATA10
LCD_DATA11: P7.34 ; port LCD_DATA11
LCD_DATA12: P7.35 ; port LCD_DATA12
LCD_DATA13: P7.33 ; port LCD_DATA13
LCD_DATA14: P7.31 ; port LCD_DATA14
LCD_DATA15: P7.32 ; port LCD_DATA15
LCD_DE: P7.30 ; port LCD_DE
LCD_HSYNC: P7.29 ; port LCD_HSYNC
LCD_PCLK: P7.28 ; port LCD_PCLK
LCD_VSYNC: P7.27 ; port LCD_VSYNC
MMC0_CD: P9.10(CD) R146.1 ; port MMC0_CD
MMC0_CLKO: P9.5(CLOCK) R142.2 ; port MMC0_CLKO
MMC0_CMD: P9.3(CMD) R141.2 ; port MMC0_CMD
MMC0_DAT0: P9.7(DAT0) R143.2 ; port MMC0_DAT0
MMC0_DAT1: P9.8(DAT1) R144.2 ; port MMC0_DAT1
MMC0_DAT2: P9.1(DAT2) R140.2 ; port MMC0_DAT2
MMC0_DAT3: P9.2(CD/DAT3) R145.2 ; port MMC0_DAT3
MMC1_CLK: P7.21 ; port MMC1_CLK
MMC1_CMD: P7.20 ; port MMC1_CMD
MMC1_DAT0: P7.25 ; port MMC1_DAT0
MMC1_DAT1: P7.24 ; port MMC1_DAT1
MMC1_DAT2: P7.5 ; port MMC1_DAT2
MMC1_DAT3: P7.6 ; port MMC1_DAT3
MMC1_DAT4: P7.23 ; port MMC1_DAT4
MMC1_DAT5: P7.22 ; port MMC1_DAT5
MMC1_DAT6: P7.3 ; port MMC1_DAT6
MMC1_DAT7: P7.4 ; port MMC1_DAT7
PWR_BUT: P8.9 ; port PWR_BUT
SPI1_CS0: P8.28 ; port SPI1_CS0
SPI1_D0: P8.29 ; port SPI1_D0
SPI1_D1: P8.30 ; port SPI1_D1
SPI1_SCLK: P8.31 ; port SPI1_SCLK
SYS_RESETn: P8.10 ; port SYS_RESETn
TIMER4: P7.7 ; port TIMER4
TIMER5: P7.9 ; port TIMER5
TIMER6: P7.10 ; port TIMER6
TIMER7: P7.8 ; port TIMER7
UART1_RXD: P8.26 ; port UART1_RXD
UART1_TXD: P8.24 ; port UART1_TXD
UART2_RXD: P8.22 ; port UART2_RXD
UART2_TXD: P8.21 ; port UART2_TXD
UART4_RXD: P8.11 ; port UART4_RXD
UART4_TXD: P8.13 ; port UART4_TXD
WP: R147.2 TP8.1(TP) U14.5(WP)

### Notes on the sheet
- EXPANSION HEADER
- (near U14) Board ID
- (near U14) 256KX8
- (near P9) uSD CONNECTOR
- Title
- Size:
- Date:
- A3
- Number:
- Time:
- Revision:
- Sheet
- of
- File:
- (in symbol microSD_CONN_2) microSD

### Library data of the parts
C168 = CAP_10uF_Y5V_10V_10%_0805: CAP CER 10UF 10V Y5V 0805; Manufacturer: TDK Corporation; Manufacturer Part Number: C2012Y5V1A106Z; Capacitance: 10µF; Temperature Coefficient: Y5V (F); Tolerance: -20%, +80%; Applications: General Purpose; Category: Capacitors; ComponentLink1Description: http://media.digikey.com/pdf/Data%20Sheets/TDK%20PDFs/C_Series_GeneralAppl_B11.pdf; ComponentLink1URL: http://media.digikey.com/pdf/Data%20Sheets/TDK%20PDFs/C_Series_GeneralAppl_B11.pdf; Features: -; Height - Seated (Max): -; Lead Spacing: -; Lead Style: -; Mounting Type: Surface Mount, MLCC; Operating Temperature: -30°C ~ 85°C; Package / Case: 0805 (2012 Metric); Packaging: Digi-Reel®; Pricing 1: 1=0.15, 10=0.105, 100=0.0499, 250=0.042, 500=0.03518, 1000=0.02887 (USD); Ratings: -; RoHS: RoHS Compliant; Size / Dimension: 0.079" L x 0.049" W (2.00mm x 1.25mm); Stock 1: 111942; Supplier 1: Digi-Key; Supplier Part Number 1: 445-1371-6-ND; Thickness (Max): 0.057" (1.45mm); Voltage - Rated: 10V
C169 C170 = CAP_0.1uF_X7R_16V_10% 0402: CAP CER 0.1UF 6.3V 10% X5R 0402; Manufacturer: TDK Corporation; Manufacturer Part Number: C1005X5R0J104K050BA; Capacitance: 0.1µF; Supplier 1: Digi-Key; Supplier Part Number 1: 445-1266-6-ND; RoHS: RoHS Compliant; Category: Capacitors; Stock 1: 127094; Pricing 1: 1=0.1, 10=0.026, 100=0.0121, 250=0.00992, 500=0.00848, 1000=0.0066, 5000=0.0055 (USD); Voltage - Rated: 6.3V; Tolerance: ±10%; Temperature Coefficient: X5R; Mounting Type: Surface Mount, MLCC; Operating Temperature: -55°C ~ 85°C; Applications: General Purpose; Ratings: -; Package / Case: 0402 (1005 Metric); Size / Dimension: 0.039" L x 0.020" W (1.00mm x 0.50mm); Height - Seated (Max): -; Thickness (Max): 0.022" (0.55mm); Lead Spacing: -; Features: -; Packaging: Digi-Reel®; Lead Style: -; ComponentLink1URL: http://product.tdk.com/capacitor/mlcc/en/documents/mlcc_commercial_general_en.pdf; ComponentLink1Description: http://product.tdk.com/capacitor/mlcc/en/documents/mlcc_commercial_general_en.pdf
P7 P8 = HDR_46_F_2_0.1_0.1: CONN HEADER FMAL 46PS.1" DL GOLD; Manufacturer: Sullins Connector Solutions; Manufacturer Part Number: PPPC232LFBN-RC; Number of Positions: 46; Number of Positions Loaded: All; Pitch: 0.100" (2.54mm); Supplier 1: Digi-Key; Supplier Part Number 1: S7126-ND; RoHS: RoHS Compliant; Category: Connectors, Interconnects; Stock 1: 750; Pricing 1: 1=2.75, 10=2.325, 25=2.2196, 50=2.0084, 100=1.7969, 250=1.58552, 500=1.4798, 1000=1.3741, 2500=1.32125 (USD); Connector Type: Header; Contact Type: Female Socket; Number of Rows: 2; Row Spacing: 0.100" (2.54mm); Mounting Type: Through Hole; Termination: Solder; Fastening Type: -; Features: -; Contact Finish: Gold; Contact Finish Thickness: Flash; Color: Black; Packaging: Bulk; ComponentLink1URL: http://www.sullinscorp.com/drawings/78_P(N)PxCxxxLFBN-RC,_10492-G.pdf; ComponentLink1Description: http://www.sullinscorp.com/drawings/78_P(N)PxCxxxLFBN-RC,_10492-G.pdf
P9 = microSD_CONN_2: CONN MICRO SD R/A PUSH-PUSH SMD; Manufacturer: Molex Inc; Manufacturer Part Number: 5025700893; Card Type: Secure Digital - microSD™ TransFlash; Number of Positions: 10 (8 + 2); Connector Type: Connector and Ejector; Insertion, Removal Method: Push In, Push Out; Supplier 1: Digi-Key; Supplier Part Number 1: WM19093TR-ND; RoHS: RoHS Compliant; Category: Connectors, Interconnects; Stock 1: 16900; Pricing 1: 1300=2.16645, 2600=2.01703, 6500=1.94233 (USD); Ejector Side: -; Mounting Type: Surface Mount, Right Angle; Features: Switch; Height Above Board: 0.071" (1.80mm); Mounting Feature: Normal, Standard - Top; Packaging: Tape & Reel (TR); Contact Finish: Gold; Contact Finish Thickness: 20µin (0.51µm); ComponentLink1URL: http://www.molex.com/pdm_docs/sd/5025700893_sd.pdf; ComponentLink1Description: http://www.molex.com/pdm_docs/sd/5025700893_sd.pdf
R140-R147 = RES_10K_1/16W_1%_0402: RES 10K OHM 1/16W 5% 0402 SMD; Manufacturer: Rohm Semiconductor; Manufacturer Part Number: MCR01MZPJ103; Power (Watts): 0.063W, 1/16W; Temperature Coefficient: ±200ppm/°C; Category: Resistors; ComponentLink1Description: http://rohmfs.rohm.com/en/products/databook/datasheet/passive/resistor/chip_resistor/mcr_a.pdf; ComponentLink1URL: http://rohmfs.rohm.com/en/products/databook/datasheet/passive/resistor/chip_resistor/mcr_a.pdf; Composition: Thick Film; Features: Automotive AEC-Q200 Qualified; Height: 0.016" (0.40mm); Number of Terminations: 2; Package / Case: 0402 (1005 Metric); Packaging: Digi-Reel®; Pricing 1: 1=0.1, 10=0.019, 25=0.014, 100=0.0078, 250=0.00596, 500=0.00476, 1000=0.0035, 5000=0.00251 (USD); Resistance (Ohms): 10k; RoHS: RoHS Compliant; Size / Dimension: 0.039" L x 0.020" W (1.00mm x 0.50mm); Stock 1: 110842; Supplier 1: Digi-Key; Supplier Device Package: 0402 (1005 Metric); Supplier Part Number 1: RHM10KJDKR-ND; Tolerance: ±5%
U14 = 24LC32A: IC EEPROM 32KBIT 400KHZ SOT23-5; Manufacturer: Microchip Technology; Manufacturer Part Number: 24LC32AT-I/OT; Format - Memory: EEPROMs - Serial; Memory Size: 32K (4K x 8); Interface: I²C, 2-Wire Serial; Voltage - Supply: 2.5 V ~ 5.5 V; Supplier 1: Digi-Key; Supplier Part Number 1: 24LC32AT-I/OTDKR-ND; RoHS: RoHS Compliant; Category: Integrated Circuits (ICs); Stock 1: 8694; Pricing 1: 1=0.5, 10=0.32, 25=0.31, 100=0.3 (USD); Memory Type: EEPROM; Speed: 400kHz; Operating Temperature: -40°C ~ 85°C; Package / Case: SC-74A, SOT-753; Supplier Device Package: SOT-23-5; Packaging: Digi-Reel®; ComponentLink1URL: http://ww1.microchip.com/downloads/en/DeviceDoc/21713M.pdf; ComponentLink1Description: http://ww1.microchip.com/downloads/en/DeviceDoc/21713M.pdf

## Sheet 01_Title_Page.SchDoc
size A4; Engineer: Ahmet Kemal Ayyildiz; Organization: AKA Design

### Notes on the sheet
- © 2020 Procenne Systems
- Title:
- Size:
- A4
- Number:
- Date:
- Rev:
- Sheet
- of

## Nets that join several sheets
DDR_VREF: 03_CPU01 (C27.2 U3.J4), 07_DDR3 (6 pins)
GND: 02_Power (32 pins), 03_CPU01 (20 pins), 04_CPU02 (23 pins), 05_CPU03 (111 pins), 06_LED&Config (26 pins), 07_DDR3 (42 pins), 08_eMMC (15 pins), 09_Ethernet (25 pins), 10_HDMI (50 pins), 11_Miscellaneous (20 pins)
GNDA_ADC: 04_CPU02 (C30.2 C31.2 C32.2 U3.A9), 05_CPU03 (C93.2 FB5.1 U3.E8), 11_Miscellaneous (P8.34)
SYS_5V: 02_Power (10 pins), 04_CPU02 (C34.1 U7.2 U7.3), 06_LED&Config (R76.1 R77.1 R78.1 R79.1), 11_Miscellaneous (P8.7 P8.8)
USB_DC: 02_Power (C2.1 U1.12), 04_CPU02 (C35.1 P3.1 R36.1 U8.6)
VDCDC2: 02_Power (C8.2 L2.2 U1.24), 05_CPU03 (11 pins)
VDCDC3: 02_Power (C10.2 L3.2 U1.29), 05_CPU03 (37 pins)
VDD_1V8: 02_Power (C11.2 R5.1 U1.40), 05_CPU03 (9 pins), 10_HDMI (FB7.2)
VDD_3V3A: 02_Power (6 pins), 03_CPU01 (9 pins), 04_CPU02 (R40.1), 05_CPU03 (42 pins), 06_LED&Config (16 pins), 11_Miscellaneous (C170.1 R147.1 U14.4)
VDD_3V3B: 02_Power (C17.1 R10.2 U2.3), 03_CPU01 (C29.1 P2.5 R23.1 R24.1), 04_CPU02 (C33.2 R26.1 U6.7 U6.8), 08_eMMC (25 pins), 09_Ethernet (7 pins), 10_HDMI (R136.2 R138.1), 11_Miscellaneous (12 pins)
VDD_ADC: 04_CPU02 (R29.1), 05_CPU03 (C93.1 FB4.1 U3.D8), 11_Miscellaneous (P8.32)
VDDS: 02_Power (R5.2 R8.1), 05_CPU03 (13 pins)
VDDS_DDR: 05_CPU03 (16 pins), 07_DDR3 (36 pins)
VRTC: 02_Power (C14.1 R7.1), 04_CPU02 (R27.1), 05_CPU03 (C105.1 U3.D7)
12MHZ: 03_CPU01 (R17.1), 10_HDMI (U13.27)
AIN0: 04_CPU02 (U3.B6), 11_Miscellaneous (P8.39)
AIN1: 04_CPU02 (U3.C7), 11_Miscellaneous (P8.40)
AIN2: 04_CPU02 (U3.B7), 11_Miscellaneous (P8.37)
AIN3: 04_CPU02 (U3.A7), 11_Miscellaneous (P8.38)
AIN4: 04_CPU02 (U3.C8), 11_Miscellaneous (P8.33)
AIN5: 04_CPU02 (U3.B8), 11_Miscellaneous (P8.36)
AIN6: 04_CPU02 (U3.A8), 11_Miscellaneous (P8.35)
CLKOUT2: 03_CPU01 (P2.18 R15.2 R16.1), 11_Miscellaneous (P8.41)
DDR_A0: 03_CPU01 (U3.F3), 07_DDR3 (U10.N3)
DDR_A1: 03_CPU01 (U3.H1), 07_DDR3 (U10.P7)
DDR_A2: 03_CPU01 (U3.E4), 07_DDR3 (U10.P3)
DDR_A3: 03_CPU01 (U3.C3), 07_DDR3 (U10.N2)
DDR_A4: 03_CPU01 (U3.C2), 07_DDR3 (U10.P8)
DDR_A5: 03_CPU01 (U3.B1), 07_DDR3 (U10.P2)
DDR_A6: 03_CPU01 (U3.D5), 07_DDR3 (U10.R8)
DDR_A7: 03_CPU01 (U3.E2), 07_DDR3 (U10.R2)
DDR_A8: 03_CPU01 (U3.D4), 07_DDR3 (U10.T8)
DDR_A9: 03_CPU01 (U3.C1), 07_DDR3 (U10.R3)
DDR_A10: 03_CPU01 (U3.F4), 07_DDR3 (U10.L7)
DDR_A11: 03_CPU01 (U3.F2), 07_DDR3 (U10.R7)
DDR_A12: 03_CPU01 (U3.E3), 07_DDR3 (U10.N7)
DDR_A13: 03_CPU01 (U3.H3), 07_DDR3 (U10.T3)
DDR_A14: 03_CPU01 (U3.H4), 07_DDR3 (U10.T7)
DDR_A15: 03_CPU01 (U3.D3), 07_DDR3 (U10.M7)
DDR_BA0: 03_CPU01 (U3.C4), 07_DDR3 (U10.M2)
DDR_BA1: 03_CPU01 (U3.E1), 07_DDR3 (U10.N8)
DDR_BA2: 03_CPU01 (U3.B3), 07_DDR3 (U10.M3)
DDR_CASn: 03_CPU01 (U3.F1), 07_DDR3 (U10.K3)
DDR_CKE: 03_CPU01 (U3.G3), 07_DDR3 (R84.2 U10.K9)
DDR_CLK: 03_CPU01 (U3.D2), 07_DDR3 (U10.J7)
DDR_CLKn: 03_CPU01 (U3.D1), 07_DDR3 (U10.K7)
DDR_CSn: 03_CPU01 (U3.H2), 07_DDR3 (U10.L2)
DDR_D0: 03_CPU01 (U3.M3), 07_DDR3 (U10.E3)
DDR_D1: 03_CPU01 (U3.M4), 07_DDR3 (U10.F7)
DDR_D2: 03_CPU01 (U3.N1), 07_DDR3 (U10.F2)
DDR_D3: 03_CPU01 (U3.N2), 07_DDR3 (U10.F8)
DDR_D4: 03_CPU01 (U3.N3), 07_DDR3 (U10.H3)
DDR_D5: 03_CPU01 (U3.N4), 07_DDR3 (U10.H8)
DDR_D6: 03_CPU01 (U3.P3), 07_DDR3 (U10.G2)
DDR_D7: 03_CPU01 (U3.P4), 07_DDR3 (U10.H7)
DDR_D8: 03_CPU01 (U3.J1), 07_DDR3 (U10.D7)
DDR_D9: 03_CPU01 (U3.K1), 07_DDR3 (U10.C3)
DDR_D10: 03_CPU01 (U3.K2), 07_DDR3 (U10.C8)
DDR_D11: 03_CPU01 (U3.K3), 07_DDR3 (U10.C2)
DDR_D12: 03_CPU01 (U3.K4), 07_DDR3 (U10.A7)
DDR_D13: 03_CPU01 (U3.L3), 07_DDR3 (U10.A2)
DDR_D14: 03_CPU01 (U3.L4), 07_DDR3 (U10.B8)
DDR_D15: 03_CPU01 (U3.M1), 07_DDR3 (U10.A3)
DDR_DQM0: 03_CPU01 (U3.M2), 07_DDR3 (U10.E7)
DDR_DQM1: 03_CPU01 (U3.J2), 07_DDR3 (U10.D3)
DDR_DQS0: 03_CPU01 (U3.P1), 07_DDR3 (U10.F3)
DDR_DQS1: 03_CPU01 (U3.L1), 07_DDR3 (U10.C7)
DDR_DQSN0: 03_CPU01 (U3.P2), 07_DDR3 (U10.G3)
DDR_DQSN1: 03_CPU01 (U3.L2), 07_DDR3 (U10.B7)
DDR_ODT: 03_CPU01 (U3.G1), 07_DDR3 (U10.K1)
DDR_RASn: 03_CPU01 (U3.G4), 07_DDR3 (U10.J3)
DDR_RESETN: 03_CPU01 (U3.G2), 07_DDR3 (R85.2 U10.T2)
DDR_WEn: 03_CPU01 (U3.B2), 07_DDR3 (U10.L3)
EHRPWM2A: 03_CPU01 (U3.U10), 11_Miscellaneous (P7.19)
EHRPWM2B: 03_CPU01 (U3.T10), 11_Miscellaneous (P7.13)
eMMC_RSTn: 03_CPU01 (R22.2), 08_eMMC (R99.2 U11.K5)
GPIO0_7: 04_CPU02 (R38.1 R39.1), 11_Miscellaneous (P8.42)
GPIO0_26: 03_CPU01 (U3.T11), 11_Miscellaneous (P7.14)
GPIO0_27: 03_CPU01 (U3.U12), 11_Miscellaneous (P7.17)
GPIO1_12: 03_CPU01 (U3.T12), 11_Miscellaneous (P7.12)
GPIO1_13: 03_CPU01 (U3.R12), 11_Miscellaneous (P7.11)
GPIO1_14: 03_CPU01 (U3.V13), 11_Miscellaneous (P7.16)
GPIO1_15: 03_CPU01 (U3.U13), 11_Miscellaneous (P7.15)
GPIO1_16: 03_CPU01 (R18.2 R19.2), 11_Miscellaneous (P8.15)
GPIO1_28: 03_CPU01 (U3.U18), 11_Miscellaneous (P8.12)
GPIO1_29: 03_CPU01 (U3.V6), 11_Miscellaneous (P7.26)
GPIO2_1: 03_CPU01 (U3.V12), 11_Miscellaneous (P7.18)
GPIO3_19: 04_CPU02 (U3.C13), 11_Miscellaneous (P8.27)
GPIO3_21: 03_CPU01 (R20.1), 04_CPU02 (U3.A14), 11_Miscellaneous (P8.25)
HDMI_INT: 03_CPU01 (U3.U16), 10_HDMI (R138.2 U13.50)
I2C0_SCL: 02_Power (R1.2 U1.28), 04_CPU02 (U3.C16), 10_HDMI (U13.52), 11_Miscellaneous (U14.1)
I2C0_SDA: 02_Power (R2.2 U1.27), 04_CPU02 (U3.C17), 10_HDMI (U13.51), 11_Miscellaneous (U14.3)
I2C1_SCL: 04_CPU02 (U3.A16), 11_Miscellaneous (P8.17)
I2C1_SDA: 04_CPU02 (U3.B16), 11_Miscellaneous (P8.18)
I2C2_SCL: 04_CPU02 (U3.D17), 11_Miscellaneous (P8.19)
I2C2_SDA: 04_CPU02 (U3.D18), 11_Miscellaneous (P8.20)
LCD_DATA0: 04_CPU02 (U3.R1), 06_LED&Config (R58.2 R75.1), 10_HDMI (C167.1 U13.15), 11_Miscellaneous (P7.45)
LCD_DATA1: 04_CPU02 (U3.R2), 06_LED&Config (R57.2 R74.1), 10_HDMI (C166.1 U13.13), 11_Miscellaneous (P7.46)
LCD_DATA2: 04_CPU02 (U3.R3), 06_LED&Config (R56.2 R59.1 R73.1), 10_HDMI (C165.1 U13.12), 11_Miscellaneous (P7.43)
LCD_DATA3: 04_CPU02 (U3.R4), 06_LED&Config (R55.2 R72.1), 10_HDMI (C164.1 U13.11), 11_Miscellaneous (P7.44)
LCD_DATA4: 04_CPU02 (U3.T1), 06_LED&Config (R54.2 R71.1), 10_HDMI (C163.1 U13.10), 11_Miscellaneous (P7.41)
LCD_DATA5: 04_CPU02 (U3.T2), 06_LED&Config (R53.2 R70.1), 10_HDMI (C157.1 U13.7), 11_Miscellaneous (P7.42)
LCD_DATA6: 04_CPU02 (U3.T3), 06_LED&Config (R52.2 R69.1), 10_HDMI (C156.1 U13.6), 11_Miscellaneous (P7.39)
LCD_DATA7: 04_CPU02 (U3.T4), 06_LED&Config (R51.2 R68.1), 10_HDMI (C155.1 U13.3), 11_Miscellaneous (P7.40)
LCD_DATA8: 04_CPU02 (U3.U1), 06_LED&Config (R50.2 R67.1), 10_HDMI (C154.1 U13.2), 11_Miscellaneous (P7.37)
LCD_DATA9: 04_CPU02 (U3.U2), 06_LED&Config (R49.2 R66.1), 10_HDMI (C153.1 U13.1), 11_Miscellaneous (P7.38)
LCD_DATA10: 04_CPU02 (U3.U3), 06_LED&Config (R48.2 R65.1), 10_HDMI (C152.1 U13.64), 11_Miscellaneous (P7.36)
LCD_DATA11: 04_CPU02 (U3.U4), 06_LED&Config (R47.2 R64.1), 10_HDMI (C162.1 U13.60), 11_Miscellaneous (P7.34)
LCD_DATA12: 04_CPU02 (U3.V2), 06_LED&Config (R46.2 R63.1), 10_HDMI (C161.1 U13.59), 11_Miscellaneous (P7.35)
LCD_DATA13: 04_CPU02 (U3.V3), 06_LED&Config (R45.2 R62.1), 10_HDMI (C160.1 U13.58), 11_Miscellaneous (P7.33)
LCD_DATA14: 04_CPU02 (U3.V4), 06_LED&Config (R44.2 R61.1), 10_HDMI (C159.1 U13.57), 11_Miscellaneous (P7.31)
LCD_DATA15: 04_CPU02 (U3.T5), 06_LED&Config (R43.2 R60.1), 10_HDMI (C158.1 U13.56), 11_Miscellaneous (P7.32)
LCD_DE: 04_CPU02 (R35.2), 10_HDMI (U13.20), 11_Miscellaneous (P7.30)
LCD_HSYNC: 04_CPU02 (R34.2), 10_HDMI (U13.22), 11_Miscellaneous (P7.29)
LCD_PCLK: 04_CPU02 (R32.2), 10_HDMI (U13.4), 11_Miscellaneous (P7.28)
LCD_VSYNC: 04_CPU02 (R33.2), 10_HDMI (U13.21), 11_Miscellaneous (P7.27)
LDO_PGOOD: 02_Power (U1.46), 03_CPU01 (U3.B5)
MDIO_CLK: 04_CPU02 (U3.M18), 09_Ethernet (U12.17)
MDIO_DATA: 04_CPU02 (U3.M17), 09_Ethernet (R100.2 U12.16)
MII1_COL: 04_CPU02 (U3.H16), 09_Ethernet (R117.1)
MII1_CRS_DV: 04_CPU02 (U3.H17), 09_Ethernet (R118.1)
MII1_REFCLK: 04_CPU02 (R30.2), 09_Ethernet (R105.1 R120.1)
MII1_RXCLK: 04_CPU02 (U3.L18), 09_Ethernet (R113.1)
MII1_RXD0: 04_CPU02 (U3.M16), 09_Ethernet (R110.1)
MII1_RXD1: 04_CPU02 (U3.L15), 09_Ethernet (R108.1)
MII1_RXD2: 04_CPU02 (U3.L16), 09_Ethernet (R107.1)
MII1_RXD3: 04_CPU02 (U3.L17), 09_Ethernet (R106.1)
MII1_RXDV: 04_CPU02 (U3.J17), 09_Ethernet (R111.1)
MII1_RXERR: 04_CPU02 (U3.J15), 09_Ethernet (R114.1)
MII1_TXCLK: 04_CPU02 (U3.K18), 09_Ethernet (R115.1)
MII1_TXD0: 04_CPU02 (U3.K17), 09_Ethernet (U12.22)
MII1_TXD1: 04_CPU02 (U3.K16), 09_Ethernet (U12.23)
MII1_TXD2: 04_CPU02 (U3.K15), 09_Ethernet (U12.24)
MII1_TXD3: 04_CPU02 (U3.J18), 09_Ethernet (U12.25)
MII1_TXEN: 04_CPU02 (U3.J16), 09_Ethernet (U12.21)
MMC0_CD: 03_CPU01 (P2.19), 04_CPU02 (U3.C15), 11_Miscellaneous (P9.10 R146.1)
MMC0_CLKO: 03_CPU01 (U3.G17), 11_Miscellaneous (P9.5 R142.2)
MMC0_CMD: 03_CPU01 (U3.G18), 11_Miscellaneous (P9.3 R141.2)
MMC0_DAT0: 03_CPU01 (U3.G16), 11_Miscellaneous (P9.7 R143.2)
MMC0_DAT1: 03_CPU01 (U3.G15), 11_Miscellaneous (P9.8 R144.2)
MMC0_DAT2: 03_CPU01 (U3.F18), 11_Miscellaneous (P9.1 R140.2)
MMC0_DAT3: 03_CPU01 (U3.F17), 11_Miscellaneous (P9.2 R145.2)
MMC1_CLK: 03_CPU01 (U3.U9), 08_eMMC (R98.2 U11.M6), 11_Miscellaneous (P7.21)
MMC1_CMD: 03_CPU01 (U3.V9), 08_eMMC (R97.2 U11.M5), 11_Miscellaneous (P7.20)
MMC1_DAT0: 03_CPU01 (U3.U7), 08_eMMC (R89.2 U11.A3), 11_Miscellaneous (P7.25)
MMC1_DAT1: 03_CPU01 (U3.V7), 08_eMMC (R90.2 U11.A4), 11_Miscellaneous (P7.24)
MMC1_DAT2: 03_CPU01 (U3.R8), 08_eMMC (R91.2 U11.A5), 11_Miscellaneous (P7.5)
MMC1_DAT3: 03_CPU01 (U3.T8), 08_eMMC (R92.2 U11.B2), 11_Miscellaneous (P7.6)
MMC1_DAT4: 03_CPU01 (U3.U8), 08_eMMC (R93.2 U11.B3), 11_Miscellaneous (P7.23)
MMC1_DAT5: 03_CPU01 (U3.V8), 08_eMMC (R94.2 U11.B4), 11_Miscellaneous (P7.22)
MMC1_DAT6: 03_CPU01 (U3.R9), 08_eMMC (R95.2 U11.B5), 11_Miscellaneous (P7.3)
MMC1_DAT7: 03_CPU01 (U3.T9), 08_eMMC (R96.2 U11.B6), 11_Miscellaneous (P7.4)
NetR16_2: 03_CPU01 (R16.2), 04_CPU02 (U3.D13)
PMIC_INT: 02_Power (R3.2 U1.45), 03_CPU01 (U3.B18)
PMIC_PGOOD: 02_Power (U1.26), 03_CPU01 (U3.B15)
PMIC_POWR_EN: 02_Power (U1.9 U1.13), 04_CPU02 (R27.2 U3.C5 U3.C6)
PWR_BUT: 02_Power (S1.2 S1.4 U1.25), 11_Miscellaneous (P8.9)
SPI1_CS0: 04_CPU02 (U3.C12), 10_HDMI (U13.25), 11_Miscellaneous (P8.28)
SPI1_D0: 04_CPU02 (U3.B13), 10_HDMI (U13.24), 11_Miscellaneous (P8.29)
SPI1_D1: 04_CPU02 (U3.D12), 11_Miscellaneous (P8.30)
SPI1_SCLK: 04_CPU02 (U3.A13), 10_HDMI (U13.23), 11_Miscellaneous (P8.31)
SYS_RESETn: 03_CPU01 (7 pins), 09_Ethernet (U12.19), 11_Miscellaneous (P8.10)
TIMER4: 03_CPU01 (U3.R7), 11_Miscellaneous (P7.7)
TIMER5: 03_CPU01 (U3.T6), 11_Miscellaneous (P7.9)
TIMER6: 03_CPU01 (U3.U6), 11_Miscellaneous (P7.10)
TIMER7: 03_CPU01 (U3.T7), 11_Miscellaneous (P7.8)
UART1_RXD: 04_CPU02 (U3.D16), 11_Miscellaneous (P8.26)
UART1_TXD: 04_CPU02 (U3.D15), 11_Miscellaneous (P8.24)
UART2_RXD: 04_CPU02 (U3.A17), 11_Miscellaneous (P8.22)
UART2_TXD: 04_CPU02 (U3.B17), 11_Miscellaneous (P8.21)
UART4_RXD: 03_CPU01 (U3.T17), 11_Miscellaneous (P8.11)
UART4_TXD: 03_CPU01 (U3.U17), 11_Miscellaneous (P8.13)
USB1_OCn: 03_CPU01 (U3.T16), 04_CPU02 (R40.2 U7.5)
USR0: 03_CPU01 (U3.V15), 06_LED&Config (Q2.2 R80.1)
USR1: 03_CPU01 (U3.U15), 06_LED&Config (Q1.5 R81.1)
USR2: 03_CPU01 (U3.T15), 06_LED&Config (Q1.2 R82.1)
USR3: 03_CPU01 (U3.V16), 06_LED&Config (Q2.5 R83.1)